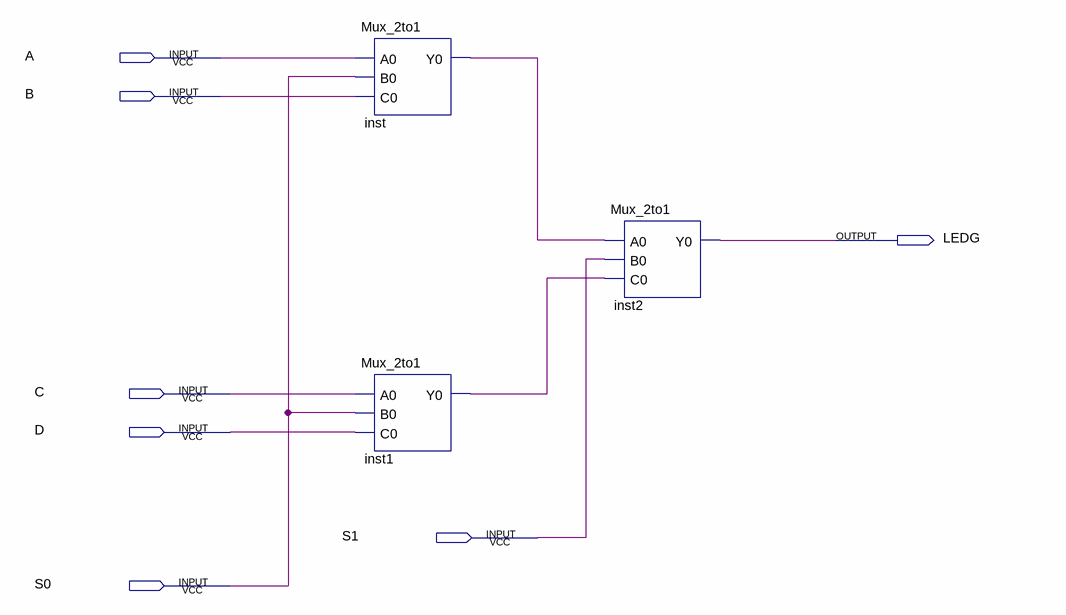
[diagram p0: schematic sheet]
// Quartus schematic 4to1.bdf as structural Verilog: 3 symbols, 7 pins
module \4to1  (
  input  A,
  input  B,
  input  C,
  input  D,
  input  S1,
  input  S0,
  output LEDG
);

  wire inst1_y0, inst_y0;

  Mux_2to1 inst (.A0(A), .B0(S0), .C0(B), .Y0(inst_y0));
  Mux_2to1 inst1 (.A0(C), .B0(S0), .C0(D), .Y0(inst1_y0));
  Mux_2to1 inst2 (.A0(inst_y0), .B0(S1), .C0(inst1_y0), .Y0(LEDG));
endmodule
